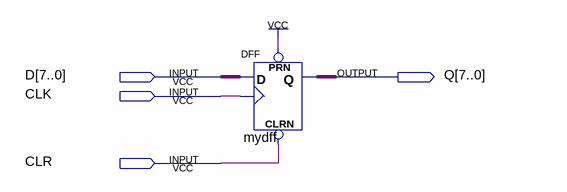
[diagram p0: schematic sheet]
// Quartus schematic REG.bdf as structural Verilog: 1 symbols, 4 pins
module REG (
  input  [7:0] D,
  input  CLK,
  input  CLR,
  output [7:0] Q
);

  DFF mydff[7:0] (.CLRN(CLR), .CLK(CLK), .D(D), .PRN(1'b1), .Q(Q));
endmodule
